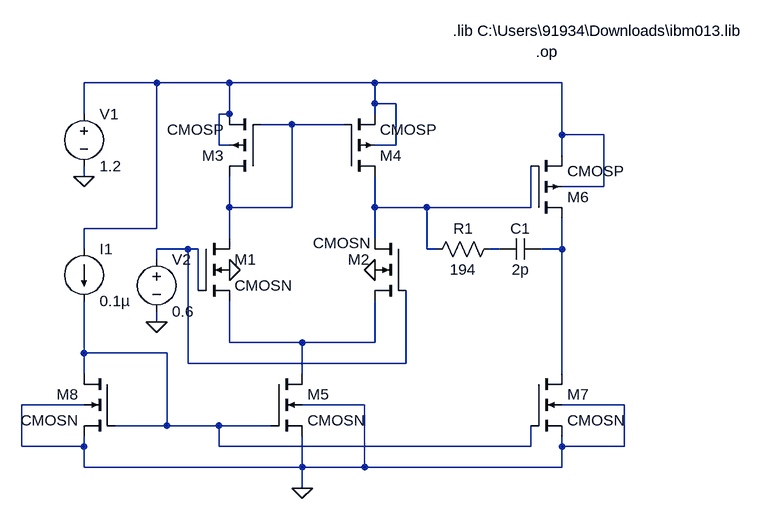
[diagram p0: schematic Biasing.asc]
Biasing.asc, the LTspice schematic file:
Version 4
SHEET 1 952 680
WIRE -16 -288 -128 -288
WIRE 96 -288 -16 -288
WIRE 320 -288 96 -288
WIRE 608 -288 320 -288
WIRE 320 -256 320 -288
WIRE 352 -256 320 -256
WIRE -128 -240 -128 -288
WIRE 96 -240 96 -288
WIRE 96 -240 80 -240
WIRE 320 -240 320 -256
WIRE 192 -224 144 -224
WIRE 272 -224 192 -224
WIRE 608 -208 608 -288
WIRE 672 -208 608 -208
WIRE 80 -192 80 -240
WIRE 96 -192 80 -192
WIRE 352 -192 352 -256
WIRE 352 -192 320 -192
WIRE 608 -176 608 -208
WIRE -128 -144 -128 -160
WIRE 672 -128 672 -208
WIRE 672 -128 608 -128
WIRE 96 -96 96 -144
WIRE 192 -96 192 -224
WIRE 192 -96 96 -96
WIRE 320 -96 320 -144
WIRE 400 -96 320 -96
WIRE 560 -96 560 -160
WIRE 560 -96 400 -96
WIRE -16 -64 -16 -288
WIRE -16 -64 -128 -64
WIRE 96 -48 96 -96
WIRE 320 -48 320 -96
WIRE -128 -32 -128 -64
WIRE 32 -32 -16 -32
WIRE 48 -32 32 -32
WIRE 400 -32 400 -96
WIRE 416 -32 400 -32
WIRE 512 -32 496 -32
WIRE 608 -32 608 -80
WIRE 608 -32 576 -32
WIRE -16 -16 -16 -32
WIRE 48 32 48 -32
WIRE -16 80 -16 64
WIRE 96 112 96 48
WIRE 208 112 96 112
WIRE 320 112 320 48
WIRE 320 112 208 112
WIRE -128 128 -128 48
WIRE 0 128 -128 128
WIRE 32 144 32 -32
WIRE 368 144 368 32
WIRE 368 144 32 144
WIRE -128 160 -128 128
WIRE 208 160 208 112
WIRE 608 160 608 -32
WIRE -128 208 -224 208
WIRE 304 208 208 208
WIRE 704 208 608 208
WIRE 0 240 0 128
WIRE 0 240 -80 240
WIRE 80 240 0 240
WIRE 160 240 80 240
WIRE -224 272 -224 208
WIRE -128 272 -128 256
WIRE -128 272 -224 272
WIRE 80 272 80 240
WIRE 560 272 560 240
WIRE 560 272 80 272
WIRE 608 272 608 256
WIRE 704 272 704 208
WIRE 704 272 608 272
WIRE -128 304 -128 272
WIRE 208 304 208 256
WIRE 208 304 -128 304
WIRE 304 304 304 208
WIRE 304 304 208 304
WIRE 608 304 608 272
WIRE 608 304 304 304
WIRE 208 336 208 304
FLAG 208 336 0
FLAG -128 -144 0
FLAG -16 80 0
FLAG 96 0 0
FLAG 320 0 0
DATAFLAG 432 -288 ""
DATAFLAG 288 144 ""
DATAFLAG 96 -128 ""
DATAFLAG 96 80 ""
DATAFLAG -32 240 ""
DATAFLAG 464 -96 ""
DATAFLAG 608 80 ""
SYMBOL nmos4 48 -48 R0
SYMATTR InstName M1
SYMATTR Value CMOSN
SYMATTR Value2 l=375n w=7.8u
SYMBOL nmos4 368 -48 M0
WINDOW 3 54 7 Left 2
SYMATTR InstName M2
SYMATTR Value CMOSN
SYMATTR Value2 l=375n w=7.8u
SYMBOL nmos4 160 160 R0
SYMATTR InstName M5
SYMATTR Value CMOSN
SYMATTR Value2 l=1u w=664u
SYMBOL nmos4 560 160 R0
SYMATTR InstName M7
SYMATTR Value CMOSN
SYMATTR Value2 l=1u w=4700u
SYMBOL nmos4 -80 160 M0
SYMATTR InstName M8
SYMATTR Value CMOSN
SYMATTR Value2 l=1u w=1u
SYMBOL current -128 -32 R0
WINDOW 123 0 0 Left 0
WINDOW 39 0 0 Left 0
SYMATTR InstName I1
SYMATTR Value 0.1µ
SYMBOL voltage -128 -256 R0
WINDOW 123 0 0 Left 0
WINDOW 39 0 0 Left 0
SYMATTR InstName V1
SYMATTR Value 1.2
SYMBOL cap 576 -48 R90
WINDOW 0 0 32 VBottom 2
WINDOW 3 32 32 VTop 2
SYMATTR InstName C1
SYMATTR Value 2p
SYMBOL res 512 -48 R90
WINDOW 0 0 56 VBottom 2
WINDOW 3 32 56 VTop 2
SYMATTR InstName R1
SYMATTR Value 194
SYMBOL voltage -16 -32 R0
WINDOW 123 0 0 Left 0
WINDOW 39 0 0 Left 0
SYMATTR InstName V2
SYMATTR Value 0.6
SYMBOL pmos4 560 -80 M180
SYMATTR InstName M6
SYMATTR Value CMOSP
SYMATTR Value2 l=120n w=36u
SYMBOL pmos4 144 -144 R180
SYMATTR InstName M3
SYMATTR Value CMOSP
SYMATTR Value2 l=120n w=2.17u
SYMBOL pmos4 272 -144 M180
SYMATTR InstName M4
SYMATTR Value CMOSP
SYMATTR Value2 l=120n w=2.17u
TEXT 440 -368 Left 2 !.lib C:\\Users\\91934\\Downloads\\ibm013.lib
TEXT 568 -336 Left 2 !.op

The netlist it stands for:
* Biasing.asc
M1 N002 N004 N007 0 CMOSN l=375n w=7.8u
M2 N003 N004 N007 0 CMOSN l=375n w=7.8u
M5 N007 N008 0 0 CMOSN l=1u w=664u
M7 N006 N008 0 0 CMOSN l=1u w=4700u
M8 N008 N008 0 0 CMOSN l=1u w=1u
I1 N001 N008 0.1µ
V1 N001 0 1.2
C1 N006 N005 2p
R1 N005 N003 194
V2 N004 0 0.6
M6 N006 N003 N001 N001 CMOSP l=120n w=36u
M3 N002 N002 N001 N001 CMOSP l=120n w=2.17u
M4 N003 N002 N001 N001 CMOSP l=120n w=2.17u
.model NMOS NMOS
.model PMOS PMOS
.lib standard.mos
.lib C:\Users\91934\Downloads\ibm013.lib
.op
.backanno
.end